# Altium schematic sheet Sheet1.SchDoc
size A4; SheetNumber: 1; SheetTotal: 1
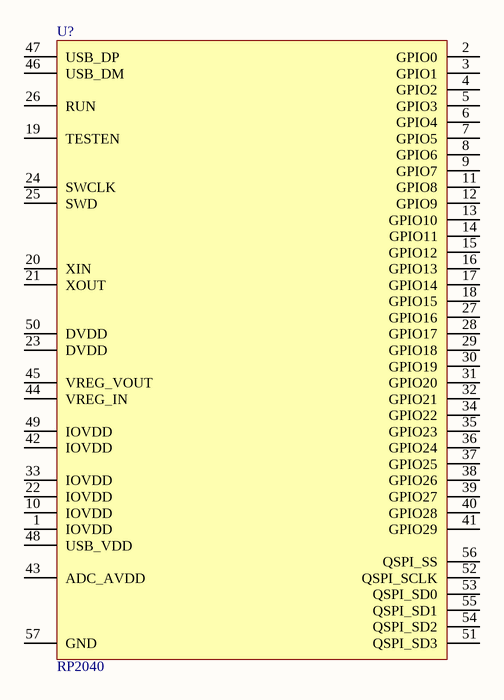
[diagram p0: Sheet1.SchDoc]

## Parts
U?  RP2040  [QFN40P700X700X90_HS-57N]

## Nets

Not connected (* = marked no-connect by the designer): U? 1(IOVDD) 2(GPIO0) 3(GPIO1) 4(GPIO2) 5(GPIO3) 6(GPIO4) 7(GPIO5) 8(GPIO6) 9(GPIO7) 10(IOVDD) 11(GPIO8) 12(GPIO9) 13(GPIO10) 14(GPIO11) 15(GPIO12) 16(GPIO13) 17(GPIO14) 18(GPIO15) 19(TESTEN) 20(XIN) 21(XOUT) 22(IOVDD) 23(DVDD) 24(SWCLK) 25(SWD) 26(RUN) 27(GPIO16) 28(GPIO17) 29(GPIO18) 30(GPIO19) 31(GPIO20) 32(GPIO21) 33(IOVDD) 34(GPIO22) 35(GPIO23) 36(GPIO24) 37(GPIO25) 38(GPIO26) 39(GPIO27) 40(GPIO28) 41(GPIO29) 42(IOVDD) 43(ADC_AVDD) 44(VREG_IN) 45(VREG_VOUT) 46(USB_DM) 47(USB_DP) 48(USB_VDD) 49(IOVDD) 50(DVDD) 51(QSPI_SD3) 52(QSPI_SCLK) 53(QSPI_SD0) 54(QSPI_SD2) 55(QSPI_SD1) 56(QSPI_SS) 57(GND)

## Library data of the parts
U? = RP2040: RP2040 microcontroller; Manufacturer: Raspberry Pi Ltd.; PartNumber: RP2040; HelpURL: https://datasheets.raspberrypi.com/rp2040/rp2040-datasheet.pdf; HelpURL 2: https://datasheets.raspberrypi.com/rp2040/hardware-design-with-rp2040.pdf; HelpURL 3: https://datasheets.raspberrypi.com/pico/raspberry-pi-pico-c-sdk.pdf; Package: QFN-56EP; Part Status: Active